# Altium project Shared_IoT_Dev.PrjPcb
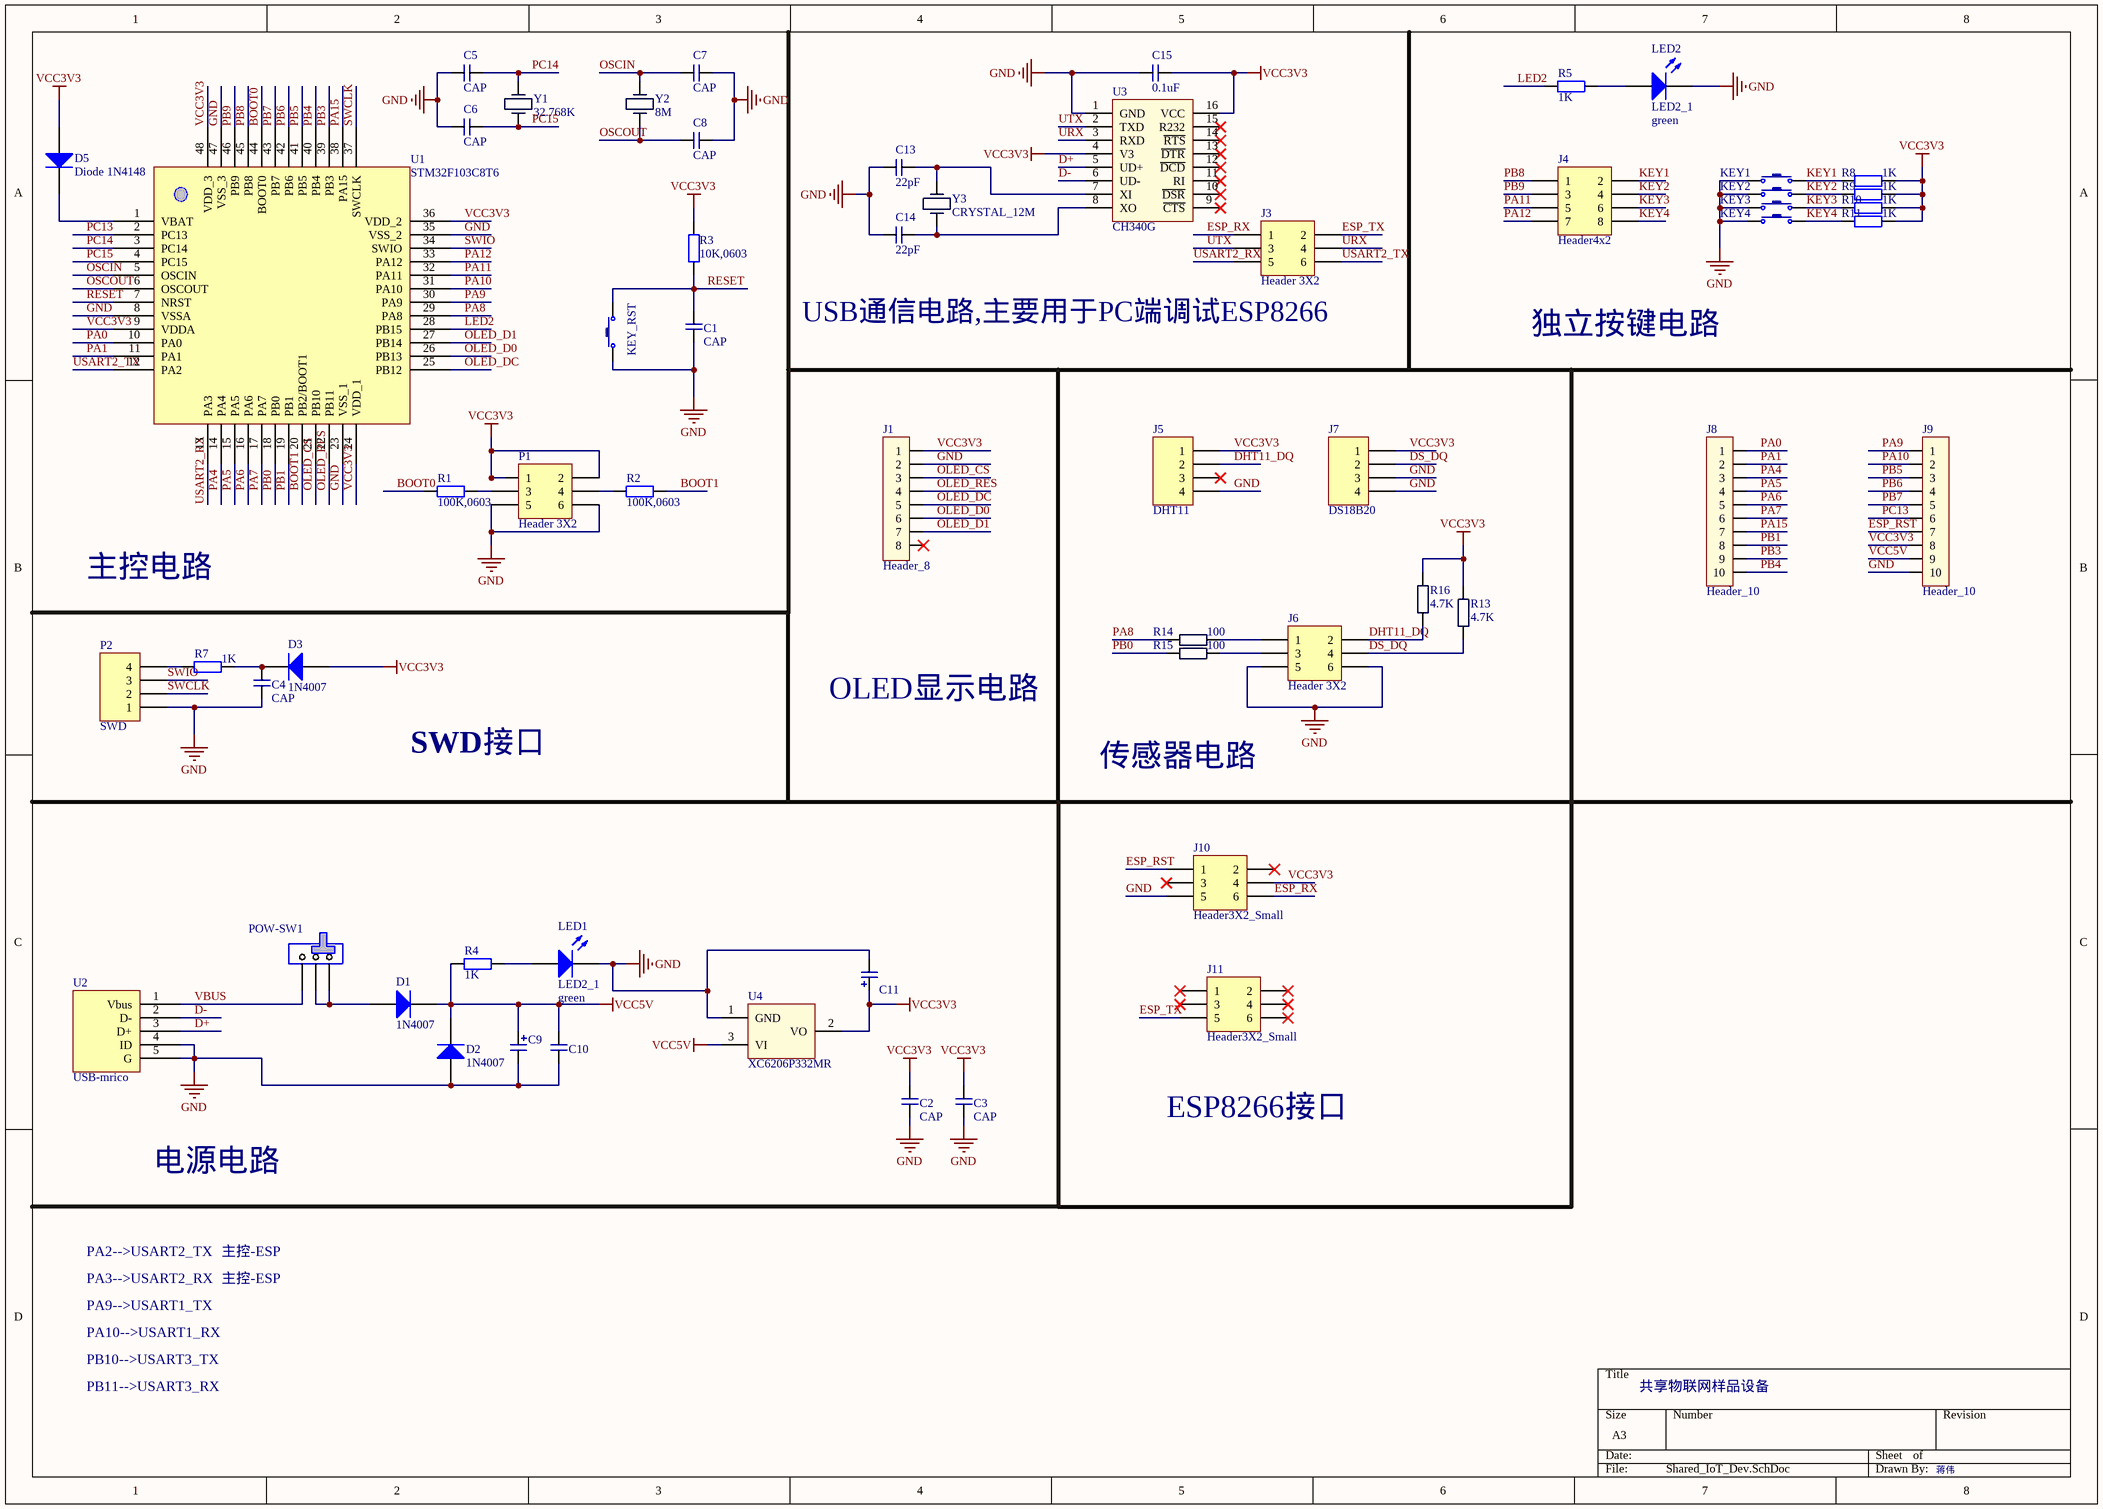
[diagram p0: Shared_IoT_Dev.SchDoc]
1 sheet, 59 parts. Net scope: global (net labels, ports and power ports of the same name join across sheets).
Board file: Shared_IoT_Dev.PcbDoc

## Sheet Shared_IoT_Dev.SchDoc
size A3

### Parts
C1  CAP  [C0805]
C2  CAP  [C0805]
C3  CAP  [C0805]
C4  CAP  [C0805]
C5  CAP  [C0805]
C6  CAP  [C0805]
C7  CAP  [C0805]
C8  CAP  [C0805]
C9  CAP_POL  [CAP-TH_POL]  (value not drawn)
C10  CAP  [C0805]  (value not drawn)
C11  CAP_POL  [CAP-TH_POL]  (value not drawn)
C13  22pF  [C0805]
C14  22pF  [C0805]
C15  0.1uF  [C0805]
D1  1N4007  [SMA]
D2  1N4007  [SMA]
D3  1N4007  [SMA]
D5  Diode 1N4148  [SMA]
J1  Header_8  [HDR-TH_8P-P2.54-V]
J3  Header 3X2  [HDR2X3]
J4  Header4x2  [HDR2X4]
J5  DHT11  [HDR1X4H]
J6  Header 3X2  [HDR2X3]
J7  DS18B20  [HDR1X4H]
J8  Header_10  [HDR-TH_10P-P2.54-V]
J9  Header_10  [HDR-TH_10P-P2.54-V]
J10  Header3X2_Small  [HDR3X2_Small]
J11  Header3X2_Small  [HDR3X2_Small]
KEY1  KEY  [KEY-TH_4P]  (value not drawn)
KEY2  KEY  [KEY-TH_4P]  (value not drawn)
KEY3  KEY  [KEY-TH_4P]  (value not drawn)
KEY4  KEY  [KEY-TH_4P]  (value not drawn)
KEY_RST  KEY  [KEY-TH_4P]  (value not drawn)
LED1  LED2_1  [0805C]
LED2  LED2_1  [0805C]
P1  Header 3X2  [HDR2X3]
P2  SWD  [HDR1X4H]
POW-SW1  Switch  [SW]  (value not drawn)
R1  100K,0603  [R0805]
R2  100K,0603  [R0805]
R3  10K,0603  [R0805]
R4  value 1K  [0805R]  (hidden comment: Res2)
R5  value 1K  [0805R]  (hidden comment: Res2)
R7  value 1K  [0805R]  (hidden comment: Res2)
R8  value 1K  [0805R]  (hidden comment: Res2)
R9  value 1K  [0805R]  (hidden comment: Res2)
R10  value 1K  [0805R]  (hidden comment: Res2)
R11  value 1K  [0805R]  (hidden comment: Res2)
R13  4.7K  [R0805]
R14  100  [R0805]
R15  100  [R0805]
R16  4.7K  [R0805]
U1  STM32F103C8T6  [48P]
U2  USB-mrico  [Micro_USB]
U3  CH340G  [CH340G_SOIC]
U4  XC6206P332MR  [XC_SOT-23-3]
Y1  32.768K  [CRYSTAL]
Y2  8M  [CRYSTAL]
Y3  CRYSTAL_12M  [CRYSTAL]

### Nets
GND: C1.2 C2.2 C3.2 C4.2 C5.1 C6.1 C7.2 C8.2 C9.2 C10.1 C11.2 C13.2 C14.2 C15.2 D2.1(A) J1.2 J5.4 J6.5 J6.6 J7.3 J7.4 J9.10 J10.5 KEY1.1 KEY2.1 KEY3.1 KEY4.1 KEY_RST.1 LED1.2(K) LED2.2(K) P1.5 P1.6 P2.1 U1.8(VSSA) U1.23(VSS_1) U1.35(VSS_2) U1.47(VSS_3) U2.4(ID) U2.5(G) U3.1(GND) U4.1(GND)
VCC3V3: C2.1 C3.1 C11.1 C15.1 D3.1(A) D5.1(A) J1.1 J5.1 J7.1 J9.8 J10.4 P1.1 P1.2 R3.2 R8.2 R9.2 R10.2 R11.2 R13.2 R16.2 U1.9(VDDA) U1.24(VDD_1) U1.36(VDD_2) U1.48(VDD_3) U3.4(V3) U3.16(VCC) U4.2(VO)
VCC5V: C9.1 C10.2 D1.2(K) D2.2(K) J9.9 R4.1 U4.3(VI)
BOOT0: R1.1 U1.44(BOOT0)
BOOT1: R2.2 U1.20(PB2/BOOT1)
D+: U2.3(D+) U3.5(UD+)
D-: U2.2(D-) U3.6(UD-)
DHT11_DQ: J5.2 J6.2 R16.1
DS_DQ: J6.4 J7.2 R13.1
ESP_RST: J9.7 J10.1
ESP_RX: J3.1 J10.6
ESP_TX: J3.2 J11.5
KEY1: J4.2 KEY1.3 R8.1
KEY2: J4.4 KEY2.3 R9.1
KEY3: J4.6 KEY3.3 R10.1
KEY4: J4.8 KEY4.3 R11.1
LED2: R5.1 U1.28(PB15)
OLED_CS: J1.3 U1.21(PB10)
OLED_D0: J1.6 U1.26(PB13)
OLED_D1: J1.7 U1.27(PB14)
OLED_DC: J1.5 U1.25(PB12)
OLED_RES: J1.4 U1.22(PB11)
OSCIN: C7.1 U1.5(OSCIN) Y2.2
OSCOUT: C8.1 U1.6(OSCOUT) Y2.1
PA0: J8.1 U1.10(PA0)
PA1: J8.2 U1.11(PA1)
PA4: J8.3 U1.14(PA4)
PA5: J8.4 U1.15(PA5)
PA6: J8.5 U1.16(PA6)
PA7: J8.6 U1.17(PA7)
PA8: R14.2 U1.29(PA8)
PA9: J9.1 U1.30(PA9)
PA10: J9.2 U1.31(PA10)
PA11: J4.5 U1.32(PA11)
PA12: J4.7 U1.33(PA12)
PA15: J8.7 U1.38(PA15)
PB0: R15.2 U1.18(PB0)
PB1: J8.8 U1.19(PB1)
PB3: J8.9 U1.39(PB3)
PB4: J8.10 U1.40(PB4)
PB5: J9.3 U1.41(PB5)
PB6: J9.4 U1.42(PB6)
PB7: J9.5 U1.43(PB7)
PB8: J4.1 U1.45(PB8)
PB9: J4.3 U1.46(PB9)
PC13: J9.6 U1.2(PC13)
PC14: C5.2 U1.3(PC14) Y1.2
PC15: C6.2 U1.4(PC15) Y1.1
RESET: C1.1 KEY_RST.3 R3.1 U1.7(NRST)
SWCLK: P2.2 U1.37(SWCLK)
SWIO: P2.3 U1.34(SWIO)
URX: J3.4 U3.3(RXD)
USART2_RX: J3.5 U1.13(PA3)
USART2_TX: J3.6 U1.12(PA2)
UTX: J3.3 U3.2(TXD)
VBUS: POW-SW1.1 U2.1(Vbus)
NetC4_1: C4.1 D3.2(K) R7.2
NetC13_1: C13.1 U3.7(XI) Y3.2
NetC14_1: C14.1 U3.8(XO) Y3.1
NetD1_1: D1.1(A) POW-SW1.2 POW-SW1.3
NetD5_2: D5.2(K) U1.1(VBAT)
NetJ6_1: J6.1 R14.1
NetJ6_3: J6.3 R15.1
NetLED1_1: LED1.1(A) R4.2
NetLED2_1: LED2.1(A) R5.2
NetP1_3: P1.3 R1.2
NetP1_4: P1.4 R2.1
NetP2_4: P2.4 R7.1

Not connected (* = marked no-connect by the designer): J1 8*; J5 3*; J10 2* 3*; J11 1* 2* 3* 4* 6*; KEY1 2 4; KEY2 2 4; KEY3 2 4; KEY4 2 4; KEY_RST 2 4; U3 9(~{CTS})* 10(~{DSR})* 11(RI)* 12(~{DCD})* 13(~{DTR})* 14(~{RTS})* 15(R232)*

### Notes on the sheet
- USB通信电路,主要用于PC端调试ESP8266
- 独立按键电路
- 主控电路
- OLED显示电路
- SWD接口
- 传感器电路
- ESP8266接口
- 电源电路
- PA2-->USART2_TX
- 主控-ESP
- PA9-->USART1_TX
- PA3-->USART2_RX
- PA10-->USART1_RX
- PB10-->USART3_TX
- PB11-->USART3_RX
- 共享物联网样品设备
- 蒋伟
- (in symbol LED2_1) green

### Library data of the parts
C13-C15 = CAP
D1-D3 = DIODE
D5 = Diode 1N4148: High Conductance Fast Diode; Published: 8-Jun-2000; LatestRevisionDate: 17-Jul-2002; LatestRevisionNote: Re-released for DXP Platform.; DatasheetVersion: 1997; PackageReference: DO-35; Publisher: Altium Limited; PackageDescription: Diode, Axial; Body 3.8 x 1.9 mm (LxDia. max), Lead Dia. 0.53 mm (max); Code_JEDEC: DO-204-AH; ComponentLink1Description: Manufacturer Link; ComponentLink1URL: http://www.fairchildsemi.com/; ComponentLink2Description: Datasheet; ComponentLink2URL: http://www.fairchildsemi.com/ds/1N%2F1N4148.pdf
J3 J6 P1 = Header 3X2: Header, 3-Pin, Dual row; LatestRevisionDate: 17-Jul-2002; LatestRevisionNote: Re-released for DXP Platform.; Publisher: Altium Limited
J5 J7 P2 = Header 4: Header, 4-Pin; LatestRevisionDate: 17-Jul-2002; LatestRevisionNote: Re-released for DXP Platform.; Publisher: Altium Limited
LED1 LED2 = LED2_1: Typical RED, GREEN, YELLOW, AMBER GaAs LED; Published: 8-Jun-2000; LatestRevisionDate: 17-Jul-2002; LatestRevisionNote: Re-released for DXP Platform.; PackageDocument: Feb-2002; PackageReference: 3.2X1.6X1.1; Publisher: Altium Limited
POW-SW1 = Swich_On_Off
R1-R3 R7 = Res2: Resistor; Published: 8-Jun-2000; LatestRevisionDate: 17-Jul-2002; LatestRevisionNote: Re-released for DXP Platform.; Publisher: Altium Limited
  R7: PackageReference: AXIAL-0.4
R4 R5 R8-R11 = Res_3: Resistor; Published: 8-Jun-2000; LatestRevisionDate: 17-Jul-2002; LatestRevisionNote: Re-released for DXP Platform.; PackageReference: AXIAL-0.4; Publisher: Altium Limited
R13-R16 = RES
U2 = usb-STM
U4 = XC6206P332MR: XC6206P332MR Power Lower to 3.3v
Y1-Y3 = CRYSTAL